# Altium project Carte_Mere.PrjPcb (part 2 of 3)

## Sheet Interface_BUS.SchDoc
size A4; Author: Audran; CompanyName: Goldorak; Address1: Electrolab; Address2: 52 rue Paul Lescop; Address3: 92000 Nanterre; DocumentNumber: 7; SheetNumber: 7; SheetTotal: 8; ProjectName: Cartes_2017
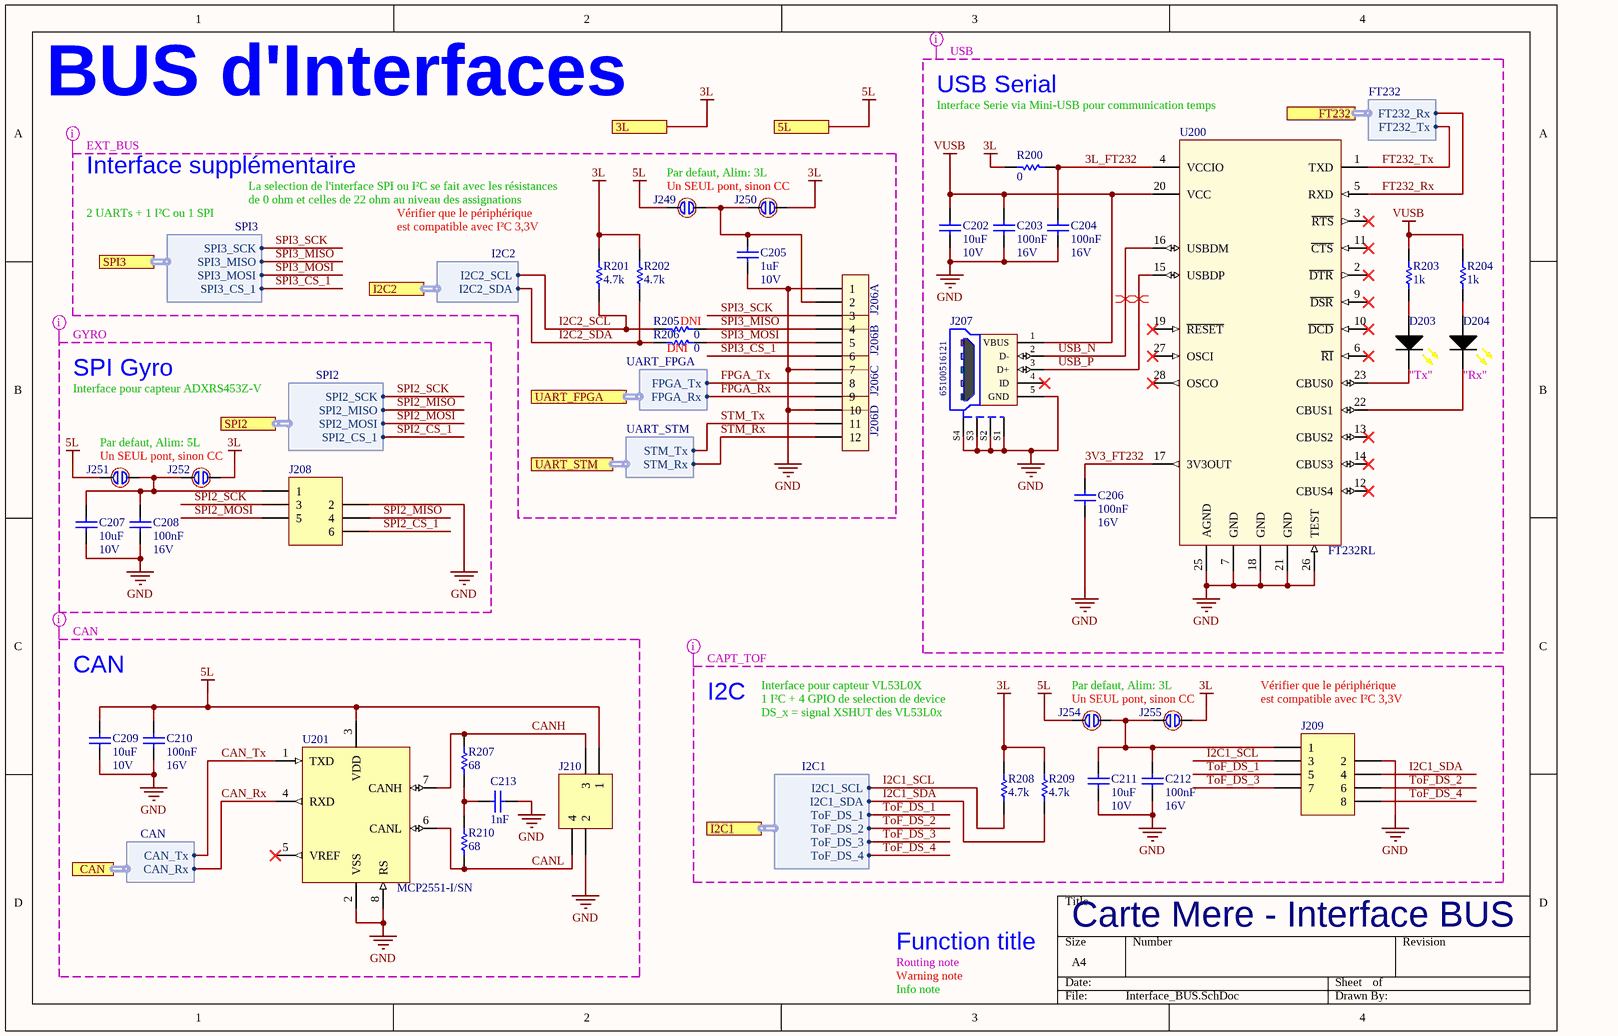
[diagram p4: Interface_BUS.SchDoc]

### Parts
C202  10uF  RatedVoltage: 10V  [WCAP-CSGP_0805, 2x1.25x1.25]
C203  100nF  RatedVoltage: 16V  [WCAP-CSGP_0402, 1x0.5x0.5]
C204  100nF  RatedVoltage: 16V  [WCAP-CSGP_0402, 1x0.5x0.5]
C205  1uF  RatedVoltage: 10V  [WCAP-CSGP_0402, 1x0.5x0.5]
C206  100nF  RatedVoltage: 16V  [WCAP-CSGP_0402, 1x0.5x0.5]
C207  10uF  RatedVoltage: 10V  [WCAP-CSGP_0805, 2x1.25x1.25]
C208  100nF  RatedVoltage: 16V  [WCAP-CSGP_0402, 1x0.5x0.5]
C209  10uF  RatedVoltage: 10V  [WCAP-CSGP_0805, 2x1.25x1.25]
C210  100nF  RatedVoltage: 16V  [WCAP-CSGP_0402, 1x0.5x0.5]
C211  10uF  RatedVoltage: 10V  [WCAP-CSGP_0805, 2x1.25x1.25]
C212  100nF  RatedVoltage: 16V  [WCAP-CSGP_0402, 1x0.5x0.5]
C213  1nF  [WCAP-CSGP_0402, 1x0.5x0.5]
D203  150060YS75000  [SMCW_0603]  (value not drawn)
D204  150060YS75000  [SMCW_0603]  (value not drawn)
J206  TSW-104-08-F-T-RA  [TSW-104-08-F-T-RA]  (value not drawn)  (parts A,B,C,D of 4)
J207  65100516121  [65100516121]
J208  690367280676  [690367280676]  (value not drawn)
J209  690367280876  [690367280876]  (value not drawn)
J210  690367280476  [690367280476]  (value not drawn)
J249  open  [CAVALIER]  (value not drawn)  (no BOM)
J250  open  [CAVALIER]  (value not drawn)  (no BOM)
J251  open  [CAVALIER]  (value not drawn)  (no BOM)
J252  open  [CAVALIER]  (value not drawn)  (no BOM)
J254  open  [CAVALIER]  (value not drawn)  (no BOM)
J255  open  [CAVALIER]  (value not drawn)  (no BOM)
R200  value 0  [RESC1608X06N]  (hidden comment: RC0603FR-070RL)
R201  value 4.7k  [RESC1005X04N]  (hidden comment: RC0402FR-074K7L)
R202  value 4.7k  [RESC1005X04N]  (hidden comment: RC0402FR-074K7L)
R203  value 1k  [RESC1005X04N]  (hidden comment: RC0402FR-071KL)
R204  value 1k  [RESC1005X04N]  (hidden comment: RC0402FR-071KL)
R205  value 0  [RESC1608X06N]  (hidden comment: RC0603FR-070RL)
R206  value 0  [RESC1608X06N]  (hidden comment: RC0603FR-070RL)
R207  value 68  [RESC1608X06N]  (hidden comment: RC0603FR-0768RL)
R208  value 4.7k  [RESC1005X04N]  (hidden comment: RC0402FR-074K7L)
R209  value 4.7k  [RESC1005X04N]  (hidden comment: RC0402FR-074K7L)
R210  value 68  [RESC1608X06N]  (hidden comment: RC0603FR-0768RL)
U200  FT232RL  [SSOP28]
U201  MCP2551-I/SN  [SOIC127P600X175-8N]

### Ports
3L, 5L, CAN (harness CAN), FT232 (harness FT232), I2C1 (harness I2C1), I2C2 (harness I2C2), SPI2 (harness SPI2), SPI3 (harness SPI3), UART_FPGA (harness UART_FPGA), UART_STM (harness UART_STM)

### Harnesses
I2C1: I2C1_SCL, I2C1_SDA, ToF_DS_1, ToF_DS_2, ToF_DS_3, ToF_DS_4
SPI2: SPI2_SCK, SPI2_MISO, SPI2_MOSI, SPI2_CS_1
CAN: CAN_Rx, CAN_Tx
FT232: FT232_Tx, FT232_Rx
SPI3: SPI3_SCK, SPI3_MISO, SPI3_MOSI, SPI3_CS_1
I2C2: I2C2_SCL, I2C2_SDA
UART_FPGA: FPGA_Tx, FPGA_Rx
UART_STM: STM_Tx, STM_Rx

### Nets
3L: J250.2 J252.2 J255.2 R200.1 R201.2 R202.2 R208.2 R209.2 ; port 3L
5L: C209.1 C210.1 J210.1 J249.1 J251.1 J254.1 U201.3(VDD) ; port 5L
GND: C202.2 C203.2 C204.2 C205.2 C206.2 C207.2 C208.2 C209.2 C210.2 C211.2 C212.2 C213.2 J206.1 J206.7 J206.10 J207.5(GND) J207.S1(Shield) J207.S2(Shield) J207.S3(Shield) J207.S4(Shield) J208.2 J209.2 J210.2 U200.7(GND) U200.18(GND) U200.21(GND) U200.25(AGND) U200.26(TEST) U201.2(VSS) U201.8(RS)
VUSB: C202.1 C203.1 J207.1(VBUS) R203.1 R204.1 U200.20(VCC)
3L_FT232: C204.1 R200.2 U200.4(VCCIO)
3V3_FT232: C206.1 U200.17(3V3OUT)
CAN_Rx: U201.4(RXD) ; port CAN.CAN_Rx
CAN_Tx: U201.1(TXD) ; port CAN.CAN_Tx
CANH: J210.3 R207.2 U201.7(CANH)
CANL: J210.4 R210.1 U201.6(CANL)
FPGA_Rx: J206.9 ; port UART_FPGA.FPGA_Rx
FPGA_Tx: J206.8 ; port UART_FPGA.FPGA_Tx
FT232_Rx: U200.5(RXD) ; port FT232.FT232_Rx
FT232_Tx: U200.1(TXD) ; port FT232.FT232_Tx
I2C1_SCL: J209.3 R208.1 ; port I2C1.I2C1_SCL
I2C1_SDA: J209.4 R209.1 ; port I2C1.I2C1_SDA
I2C2_SCL: R201.1 R205.1 ; port I2C2.I2C2_SCL
I2C2_SDA: R202.1 R206.1 ; port I2C2.I2C2_SDA
SPI2_CS_1: J208.6 ; port SPI2.SPI2_CS_1
SPI2_MISO: J208.4 ; port SPI2.SPI2_MISO
SPI2_MOSI: J208.5 ; port SPI2.SPI2_MOSI
SPI2_SCK: J208.3 ; port SPI2.SPI2_SCK
SPI3_CS_1: J206.6 ; port SPI3.SPI3_CS_1
SPI3_MISO: J206.4 R205.2 ; port SPI3.SPI3_MISO
SPI3_MOSI: J206.5 R206.2 ; port SPI3.SPI3_MOSI
SPI3_SCK: J206.3 ; port SPI3.SPI3_SCK
STM_Rx: J206.12 ; port UART_STM.STM_Rx
STM_Tx: J206.11 ; port UART_STM.STM_Tx
ToF_DS_1: J209.5 ; port I2C1.ToF_DS_1
ToF_DS_2: J209.6 ; port I2C1.ToF_DS_2
ToF_DS_3: J209.7 ; port I2C1.ToF_DS_3
ToF_DS_4: J209.8 ; port I2C1.ToF_DS_4
USB_N: J207.2(D-) U200.16(USBDM)
USB_P: J207.3(D+) U200.15(USBDP)
NetC205_1: C205.1 J206.2 J249.2 J250.1
NetC207_1: C207.1 C208.1 J208.1 J251.2 J252.1
NetC211_1: C211.1 C212.1 J209.1 J254.2 J255.1
NetC213_1: C213.1 R207.1 R210.2
NetD203_1: D203.1(C) U200.23(CBUS0)
NetD203_2: D203.2(A) R203.2
NetD204_1: D204.1(C) U200.22(CBUS1)
NetD204_2: D204.2(A) R204.2

Not connected (* = marked no-connect by the designer): J207 4(ID)*; U200 2(~{DTR})* 3(~{RTS})* 6(~{RI})* 9(~{DSR})* 10(~{DCD})* 11(~{CTS})* 12(CBUS4)* 13(CBUS2)* 14(CBUS3)* 19(~{RESET})* 27(OSCI)* 28(OSCO)*; U201 5(VREF)*

### Layout directives
differential pair: USB_N, USB_P
net class USB: 3L, 3L_FT232, 3V3_FT232, FT232_Rx, FT232_Tx, GND, USB_N, USB_P, VUSB
net class CAPT_TOF: 3L, 5L, GND, I2C1_SCL, I2C1_SDA, ToF_DS_1, ToF_DS_2, ToF_DS_3, ToF_DS_4
net class CAN: 5L, CAN_Rx, CAN_Tx, CANH, CANL, GND
net class GYRO: 3L, 5L, GND, SPI2_CS_1, SPI2_MISO, SPI2_MOSI, SPI2_SCK
net class EXT_BUS: 3L, 5L, FPGA_Rx, FPGA_Tx, GND, I2C2_SCL, I2C2_SDA, SPI3_CS_1, SPI3_MISO, SPI3_MOSI, SPI3_SCK, STM_Rx, STM_Tx

### Notes on the sheet
- BUS d'Interfaces
- USB Serial
- Interface Serie via Mini-USB pour communication temps
- Interface supplémentaire
- Par defaut, Alim: 3L
- 2 UARTs + 1 I²C ou 1 SPI
- (near J249) La selection de l'interface SPI ou I²C se fait avec les résistances
- de 0 ohm et celles de 22 ohm au niveau des assignations
- (near R201) Vérifier que le périphérique
- (near R201) est compatible avec I²C 3,3V
- Un SEUL pont, sinon CC
- SPI Gyro
- (near R206) DNI
- (near R205) DNI
- "Tx"
- (near D204) "Rx"
- Interface pour capteur ADXRS453Z-V
- Par defaut, Alim: 5L
- CAN
- I2C
- Interface pour capteur VL53L0X
- 1 I²C + 4 GPIO de selection de device
- DS_x = signal XSHUT des VL53L0x
- Vérifier que le périphérique
- (near J209) est compatible avec I²C 3,3V
- Routing note
- Warning note
- Function title
- Carte Mere - Interface BUS
- Info note

### Library data of the parts
C202 C207 C209 C211 = WCAP-CSGP, 885012207026: as C200 on sheet DE0_Nano; ComponentLink1Description: Datasheet; ComponentLink1URL: http://katalog.we-online.com/pbs/datasheet/885012207026.pdf; Manufacturer Part Number: 885012207026; Value: 10uF; Size: 0805; CeramicType: X7R; Supplier 1: Farnell; Supplier Part Number 1: 2495189; Supplier Part Number 2: C15850; Supplier 2: JLCPCB; Supplier Footprint 2: 0805
C203 C204 C206 C208 C210 C212 = WCAP-CSGP, 885012205037: as C201 on sheet DE0_Nano; ComponentLink1Description: Datasheet; ComponentLink1URL: http://katalog.we-online.com/pbs/datasheet/885012205037.pdf; Manufacturer Part Number: 885012205037; Value: 100nF; Size: 0402; CeramicType: X7R; Supplier 2: JLCPCB; Supplier Part Number 2: C1525; Supplier Footprint 2: 0402
C205 = WCAP-CSGP, 885012105012: CAP CER 1UF 10V X5R 0402; Manufacturer: Wurth Elektronik; ComponentLink1Description: Datasheet; ComponentLink1URL: http://katalog.we-online.com/pbs/datasheet/885012105012.pdf; Manufacturer Part Number: 885012105012; Value: 1uF; Size: 0402; CeramicType: X5R; Supplier 2: JLCPCB; Supplier Part Number 2: C52923; Supplier Footprint 2: 0402
C213 = WCAP-CSGP, 885012205061: CAP CER 1nF 50V X7R 0402; Manufacturer: Wurth Elektronik; ComponentLink1Description: Datasheet; ComponentLink1URL: http://katalog.we-online.com/pbs/datasheet/885012205061.pdf; Manufacturer Part Number: 885012205061; Value: 1nF; Size: 0402; CeramicType: X7R; RatedVoltage: 50V; Supplier 2: JLCPCB; Supplier Part Number 2: C1523; Supplier Footprint 2: 0402
D203 D204 = WL-SMCW 0603  150060YS75000: SMD mono-color Chip LED, WL-SMCW, Yellow; Manufacturer: Wurth Elektronik; Value: Jaune; Manufacturer Part Number: 150060YS75000; ComponentLink1Description: Datasheet; ComponentLink1URL: http://katalog.we-online.com/led/datasheet/150060YS75000.pdf; Supplier 1: Farnell; Supplier Part Number 1: 2322074; Supplier 2: JLCPCB; Supplier Part Number 2: C72038; Supplier Footprint 2: LED_0603
J206 = TSW-104-08-F-T-RA: CONN HEADER R/A 3L x 4POS 2.54MM; Manufacturer: SAMTEC; Manufacturer Part Number: TSW-104-08-F-T-RA; Supplier 1: Farnell; Supplier Part Number 1: 2053041; ComponentLink1Description: Datasheet; ComponentLink1URL: http://cloud.samtec.com/catalog_english/TSW_TH.PDF
J207 = 65100516121: Mini USB 2.0 Type B, Receptacle, Horizontal, SMT; Manufacturer: Wurth Elektronik; Value: 5; ComponentLink1Description: Manufacturer; ComponentLink1URL: https://www.we-online.com/catalog/en/COM_SMT_MINI_TYPE_B_HORIZONTAL/#65100516121; ComponentLink2Description: Datasheet; ComponentLink2URL: https://katalog.we-online.com/em/datasheet/65100516121.pdf; Manufacturer Part Number: 65100516121; Supplier 1: Farnell; Supplier Part Number 1: 1642036
J208 = 690367280676: WR-MM 6p Female SMT Connector with Polarization; Manufacturer: Wurth Electronics Inc.; Value: 6; ComponentLink1Description: Datasheet; ComponentLink1URL: http://katalog.we-online.de/em/datasheet/69036728xx76.pdf; Manufacturer Part Number: 690367280676; Supplier 1: Farnell; Supplier Part Number 1: 1641849
J209 = 690367280876: as J241 on sheet Capteur; ComponentLink1Description: Datasheet; ComponentLink1URL: http://katalog.we-online.de/em/datasheet/69036728xx76.pdf; Manufacturer Part Number: 690367280876; Supplier 1: Farnell; Supplier Part Number 1: 1641850
J210 = 690367280476: WR-MM 4p Female SMT Connector with Polarization; Manufacturer: Wurth Electronics Inc.; Value: 4; ComponentLink1Description: Datasheet; ComponentLink1URL: http://katalog.we-online.de/em/datasheet/69036728xx76.pdf; Manufacturer Part Number: 690367280476; Supplier 1: Farnell; Supplier Part Number 1: 1641848
J249-J252 J254 J255 = CAVALIER_DOT: Cavalier soudure "ouvert", pastille fendue 1.2mm
R200 R205 R206 = RC0603FR-070RL: as R251 on sheet Capteur; Manufacturer Part Number: RC0603FR-070RL; Type: Thick Film; ComponentLink1Description: Manufacturer; ComponentLink1URL: http://www.yageo.com/NewPortal/_en/index.jsp; ComponentLink2Description: Datasheet; ComponentLink2URL: http://www.farnell.com/datasheets/2167052.pdf; Supplier 1: Farnell; Precision: ±1%; Supplier Part Number 1: 2309106; Supplier 2: JLCPCB; Supplier Part Number 2: C21189; Supplier Footprint 2: 0603
R201 R202 R208 R209 = RC0402FR-074K7L: RES SMD 4K7 OHM 1% 1/16W 0402; Manufacturer: Yageo; Power: 63mW; Vmax: 50V; Type: Thick Film; ComponentLink1Description: Manufacturer; ComponentLink1URL: http://www.yageo.com/NewPortal/_en/index.jsp; ComponentLink2Description: Datasheet; ComponentLink2URL: http://www.farnell.com/datasheets/2167052.pdf; Manufacturer Part Number: RC0402FR-074K7L; Supplier 1: Farnell; Supplier Part Number 1: 9239316; Precision: ±1%; Supplier 2: JLCPCB; Supplier Part Number 2: C25900; Supplier Footprint 2: 0402
R203 R204 = RC0402FR-071KL: RES SMD 1K OHM 1% 1/16W 0402; Manufacturer: Yageo; Power: 63mW; Vmax: 50V; Type: Thick Film; ComponentLink1Description: Manufacturer; ComponentLink1URL: http://www.yageo.com/NewPortal/_en/index.jsp; ComponentLink2Description: Datasheet; ComponentLink2URL: http://www.farnell.com/datasheets/2167052.pdf; Manufacturer Part Number: RC0402FR-071KL; Supplier 1: Farnell; Supplier Part Number 1: 9239235; Precision: ±1%; Supplier 2: JLCPCB; Supplier Part Number 2: C11702; Supplier Footprint 2: 0402
R207 R210 = RC0603FR-0768RL: RES SMD 68 OHM 1% 1/10W 0603; Manufacturer: Yageo; Power: 100mW; Vmax: 50V; Manufacturer Part Number: RC0603FR-0768RL; Type: Thick Film; ComponentLink1Description: Manufacturer; ComponentLink1URL: http://www.yageo.com/NewPortal/_en/index.jsp; ComponentLink2Description: Datasheet; ComponentLink2URL: http://www.farnell.com/datasheets/1868787.pdf; Supplier 1: Farnell; Supplier Part Number 1: 9238344; Precision: ±1%; Supplier 2: JLCPCB; Supplier Part Number 2: C27592; Supplier Footprint 2: 0603
U200 = FT232RL: USB VERS UART CMS SSOP28 232; Manufacturer: FTDI; Manufacturer Part Number: FT232RL; Supplier 1: Farnell; Supplier Part Number 1: 1146032; ComponentLink1Description: Datasheet; ComponentLink1URL: http://www.farnell.com/datasheets/2007793.pdf; Supplier 2: JLCPCB; Supplier Footprint 2: SSOP-28_5.3x10.2x0.65P; Supplier Part Number 2: C8690
U201 = MCP2551-I/SN: IC TRANSCEIVER CAN HI-SPD 8-SOIC; Manufacturer: Microchip Technology; Manufacturer Part Number: MCP2551-I/SN; ComponentLink1Description: Datasheet; ComponentLink1URL: http://www.farnell.com/datasheets/657417.pdf; Supplier 1: Farnell; Supplier Part Number 1: 9758569; Supplier 2: JLCPCB; Supplier Part Number 2: C7439; Supplier Footprint 2: SOIC-8_3.9x4.9x1.27P

## Sheet Motorisation.SchDoc
size A4; Author: Audran; CompanyName: Goldorak; Address1: Electrolab; Address2: 52 rue Paul Lescop; Address3: 92000 Nanterre; DocumentNumber: 8; SheetNumber: 8; SheetTotal: 8; ProjectName: Cartes_2017
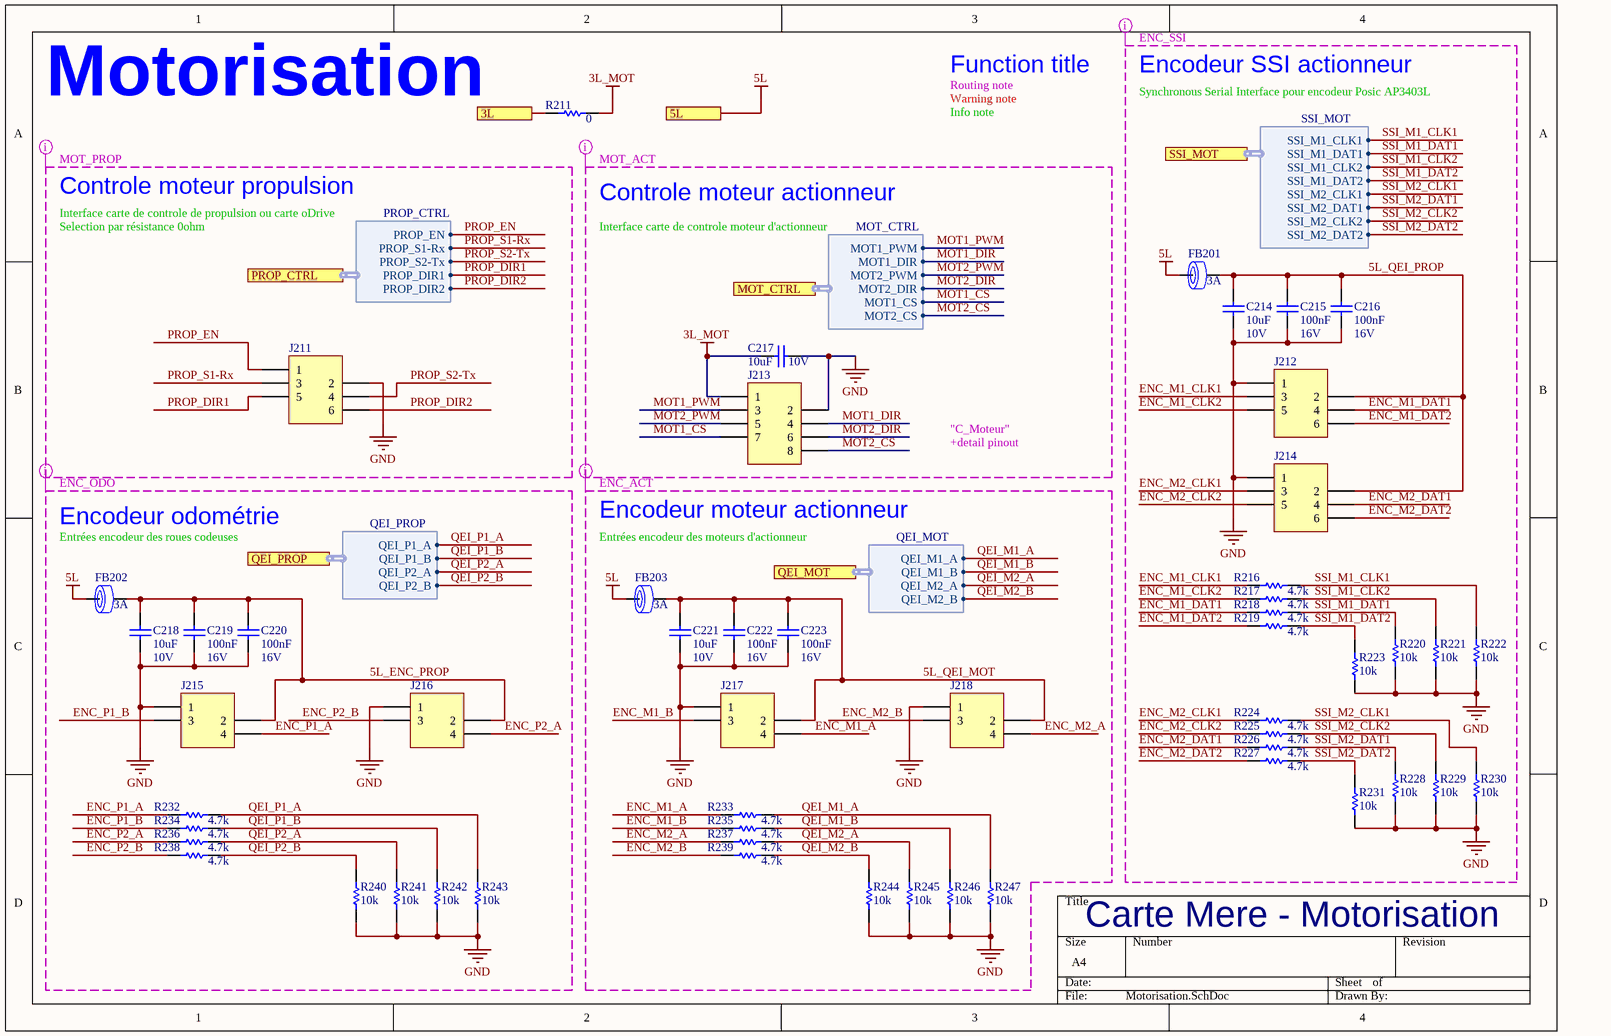
[diagram p5: Motorisation.SchDoc]

### Parts
C214  10uF  RatedVoltage: 10V  [WCAP-CSGP_0805, 2x1.25x1.25]
C215  100nF  RatedVoltage: 16V  [WCAP-CSGP_0402, 1x0.5x0.5]
C216  100nF  RatedVoltage: 16V  [WCAP-CSGP_0402, 1x0.5x0.5]
C217  10uF  RatedVoltage: 10V  [WCAP-CSGP_0805, 2x1.25x1.25]
C218  10uF  RatedVoltage: 10V  [WCAP-CSGP_0805, 2x1.25x1.25]
C219  100nF  RatedVoltage: 16V  [WCAP-CSGP_0402, 1x0.5x0.5]
C220  100nF  RatedVoltage: 16V  [WCAP-CSGP_0402, 1x0.5x0.5]
C221  10uF  RatedVoltage: 10V  [WCAP-CSGP_0805, 2x1.25x1.25]
C222  100nF  RatedVoltage: 16V  [WCAP-CSGP_0402, 1x0.5x0.5]
C223  100nF  RatedVoltage: 16V  [WCAP-CSGP_0402, 1x0.5x0.5]
FB201  RatedCurrent: 3A  [WE-CBF_0805_High Current]  (hidden comment: 742792023)
FB202  RatedCurrent: 3A  [WE-CBF_0805_High Current]  (hidden comment: 742792023)
FB203  RatedCurrent: 3A  [WE-CBF_0805_High Current]  (hidden comment: 742792023)
J211  690367280676  [690367280676]  (value not drawn)
J212  690367280676  [690367280676]  (value not drawn)
J213  690367280876  [690367280876]  (value not drawn)
J214  690367280676  [690367280676]  (value not drawn)
J215  690367280476  [690367280476]  (value not drawn)
J216  690367280476  [690367280476]  (value not drawn)
J217  690367280476  [690367280476]  (value not drawn)
J218  690367280476  [690367280476]  (value not drawn)
R211  value 0  [RESC1608X06N]  (hidden comment: RC0603FR-070RL)
R216  value 4.7k  [RESC1005X04N]  (hidden comment: RC0402FR-074K7L)
R217  value 4.7k  [RESC1005X04N]  (hidden comment: RC0402FR-074K7L)
R218  value 4.7k  [RESC1005X04N]  (hidden comment: RC0402FR-074K7L)
R219  value 4.7k  [RESC1005X04N]  (hidden comment: RC0402FR-074K7L)
R220  value 10k  [RESC1005X04N]  (hidden comment: RC0402FR-0710KL)
R221  value 10k  [RESC1005X04N]  (hidden comment: RC0402FR-0710KL)
R222  value 10k  [RESC1005X04N]  (hidden comment: RC0402FR-0710KL)
R223  value 10k  [RESC1005X04N]  (hidden comment: RC0402FR-0710KL)
R224  value 4.7k  [RESC1005X04N]  (hidden comment: RC0402FR-074K7L)
R225  value 4.7k  [RESC1005X04N]  (hidden comment: RC0402FR-074K7L)
R226  value 4.7k  [RESC1005X04N]  (hidden comment: RC0402FR-074K7L)
R227  value 4.7k  [RESC1005X04N]  (hidden comment: RC0402FR-074K7L)
R228  value 10k  [RESC1005X04N]  (hidden comment: RC0402FR-0710KL)
R229  value 10k  [RESC1005X04N]  (hidden comment: RC0402FR-0710KL)
R230  value 10k  [RESC1005X04N]  (hidden comment: RC0402FR-0710KL)
R231  value 10k  [RESC1005X04N]  (hidden comment: RC0402FR-0710KL)
R232  value 4.7k  [RESC1005X04N]  (hidden comment: RC0402FR-074K7L)
R233  value 4.7k  [RESC1005X04N]  (hidden comment: RC0402FR-074K7L)
R234  value 4.7k  [RESC1005X04N]  (hidden comment: RC0402FR-074K7L)
R235  value 4.7k  [RESC1005X04N]  (hidden comment: RC0402FR-074K7L)
R236  value 4.7k  [RESC1005X04N]  (hidden comment: RC0402FR-074K7L)
R237  value 4.7k  [RESC1005X04N]  (hidden comment: RC0402FR-074K7L)
R238  value 4.7k  [RESC1005X04N]  (hidden comment: RC0402FR-074K7L)
R239  value 4.7k  [RESC1005X04N]  (hidden comment: RC0402FR-074K7L)
R240  value 10k  [RESC1005X04N]  (hidden comment: RC0402FR-0710KL)
R241  value 10k  [RESC1005X04N]  (hidden comment: RC0402FR-0710KL)
R242  value 10k  [RESC1005X04N]  (hidden comment: RC0402FR-0710KL)
R243  value 10k  [RESC1005X04N]  (hidden comment: RC0402FR-0710KL)
R244  value 10k  [RESC1005X04N]  (hidden comment: RC0402FR-0710KL)
R245  value 10k  [RESC1005X04N]  (hidden comment: RC0402FR-0710KL)
R246  value 10k  [RESC1005X04N]  (hidden comment: RC0402FR-0710KL)
R247  value 10k  [RESC1005X04N]  (hidden comment: RC0402FR-0710KL)

### Ports
3L, 5L, MOT_CTRL (harness MOT_CTRL), PROP_CTRL (harness PROP_CTRL), QEI_MOT (harness QEI_MOT), QEI_PROP (harness QEI_PROP), SSI_MOT (harness SSI_MOT)

### Harnesses
PROP_CTRL: PROP_EN, PROP_S1-Rx, PROP_S2-Tx, PROP_DIR1, PROP_DIR2
QEI_PROP: QEI_P1_A, QEI_P1_B, QEI_P2_A, QEI_P2_B
QEI_MOT: QEI_M1_A, QEI_M1_B, QEI_M2_A, QEI_M2_B
SSI_MOT: SSI_M1_CLK1, SSI_M1_DAT1, SSI_M1_CLK2, SSI_M1_DAT2, SSI_M2_CLK1, SSI_M2_DAT1, SSI_M2_CLK2, SSI_M2_DAT2
MOT_CTRL: MOT1_PWM, MOT1_DIR, MOT2_PWM, MOT2_DIR, MOT1_CS, MOT2_CS

### Nets
3L: R211.1 ; port 3L
3L_MOT: C217.1 J213.1 R211.2
5L: FB201.1 FB202.1 FB203.1 ; port 5L
GND: C214.2 C215.2 C216.2 C217.2 C218.2 C219.2 C220.2 C221.2 C222.2 C223.2 J211.2 J212.1 J213.2 J214.1 J215.1 J216.1 J217.1 J218.1 R220.1 R221.1 R222.1 R223.1 R228.1 R229.1 R230.1 R231.1 R240.1 R241.1 R242.1 R243.1 R244.1 R245.1 R246.1 R247.1
5L_ENC_PROP: C218.1 C219.1 C220.1 FB202.2 J215.2 J216.2
5L_QEI_MOT: C221.1 C222.1 C223.1 FB203.2 J217.2 J218.2
5L_QEI_PROP: C214.1 C215.1 C216.1 FB201.2 J212.2 J214.2
ENC_M1_A: J217.4 R233.1
ENC_M1_B: J217.3 R235.1
ENC_M1_CLK1: J212.3 R216.1
ENC_M1_CLK2: J212.5 R217.1
ENC_M1_DAT1: J212.4 R218.1
ENC_M1_DAT2: J212.6 R219.1
ENC_M2_A: J218.4 R237.1
ENC_M2_B: J218.3 R239.1
ENC_M2_CLK1: J214.3 R224.1
ENC_M2_CLK2: J214.5 R225.1
ENC_M2_DAT1: J214.4 R226.1
ENC_M2_DAT2: J214.6 R227.1
ENC_P1_A: J215.4 R232.1
ENC_P1_B: J215.3 R234.1
ENC_P2_A: J216.4 R236.1
ENC_P2_B: J216.3 R238.1
MOT1_CS: J213.7 ; port MOT_CTRL.MOT1_CS
MOT1_DIR: J213.4 ; port MOT_CTRL.MOT1_DIR
MOT1_PWM: J213.3 ; port MOT_CTRL.MOT1_PWM
MOT2_CS: J213.8 ; port MOT_CTRL.MOT2_CS
MOT2_DIR: J213.6 ; port MOT_CTRL.MOT2_DIR
MOT2_PWM: J213.5 ; port MOT_CTRL.MOT2_PWM
PROP_DIR1: J211.5 ; port PROP_CTRL.PROP_DIR1
PROP_DIR2: J211.6 ; port PROP_CTRL.PROP_DIR2
PROP_EN: J211.1 ; port PROP_CTRL.PROP_EN
PROP_S1-Rx: J211.3 ; port PROP_CTRL.PROP_S1-Rx
PROP_S2-Tx: J211.4 ; port PROP_CTRL.PROP_S2-Tx
QEI_M1_A: R233.2 R247.2 ; port QEI_MOT.QEI_M1_A
QEI_M1_B: R235.2 R246.2 ; port QEI_MOT.QEI_M1_B
QEI_M2_A: R237.2 R245.2 ; port QEI_MOT.QEI_M2_A
QEI_M2_B: R239.2 R244.2 ; port QEI_MOT.QEI_M2_B
QEI_P1_A: R232.2 R243.2 ; port QEI_PROP.QEI_P1_A
QEI_P1_B: R234.2 R242.2 ; port QEI_PROP.QEI_P1_B
QEI_P2_A: R236.2 R241.2 ; port QEI_PROP.QEI_P2_A
QEI_P2_B: R238.2 R240.2 ; port QEI_PROP.QEI_P2_B
SSI_M1_CLK1: R216.2 R222.2 ; port SSI_MOT.SSI_M1_CLK1
SSI_M1_CLK2: R217.2 R221.2 ; port SSI_MOT.SSI_M1_CLK2
SSI_M1_DAT1: R218.2 R220.2 ; port SSI_MOT.SSI_M1_DAT1
SSI_M1_DAT2: R219.2 R223.2 ; port SSI_MOT.SSI_M1_DAT2
SSI_M2_CLK1: R224.2 R230.2 ; port SSI_MOT.SSI_M2_CLK1
SSI_M2_CLK2: R225.2 R229.2 ; port SSI_MOT.SSI_M2_CLK2
SSI_M2_DAT1: R226.2 R228.2 ; port SSI_MOT.SSI_M2_DAT1
SSI_M2_DAT2: R227.2 R231.2 ; port SSI_MOT.SSI_M2_DAT2

### Layout directives
net class MOT_PROP: GND, PROP_DIR1, PROP_DIR2, PROP_EN, PROP_S1-Rx, PROP_S2-Tx
net class MOT_ACT: 3L_MOT, GND, MOT1_CS, MOT1_DIR, MOT1_PWM, MOT2_CS, MOT2_DIR, MOT2_PWM
net class ENC_ODO: 5L, 5L_ENC_PROP, ENC_P1_A, ENC_P1_B, ENC_P2_A, ENC_P2_B, GND, QEI_P1_A, QEI_P1_B, QEI_P2_A, QEI_P2_B
net class ENC_SSI: 5L, 5L_QEI_PROP, ENC_M1_CLK1, ENC_M1_CLK2, ENC_M1_DAT1, ENC_M1_DAT2, ENC_M2_CLK1, ENC_M2_CLK2, ENC_M2_DAT1, ENC_M2_DAT2, GND, SSI_M1_CLK1, SSI_M1_CLK2, SSI_M1_DAT1, SSI_M1_DAT2, SSI_M2_CLK1, SSI_M2_CLK2, SSI_M2_DAT1, SSI_M2_DAT2
net class ENC_ACT: 5L, 5L_QEI_MOT, ENC_M1_A, ENC_M1_B, ENC_M2_A, ENC_M2_B, GND, QEI_M1_A, QEI_M1_B, QEI_M2_A, QEI_M2_B

### Notes on the sheet
- Motorisation
- Routing note
- Warning note
- Info note
- Function title
- Encodeur SSI actionneur
- Synchronous Serial Interface pour encodeur Posic AP3403L
- Controle moteur propulsion
- Interface carte de controle de propulsion ou carte oDrive
- Selection par résistance 0ohm
- Controle moteur actionneur
- Interface carte de controle moteur d'actionneur
- "C_Moteur"
- +detail pinout
- Encodeur moteur actionneur
- Encodeur odométrie
- Entrées encodeur des roues codeuses
- Entrées encodeur des moteurs d'actionneur
- Carte Mere - Motorisation

### Library data of the parts
C214 C217 C218 C221 = WCAP-CSGP, 885012207026: CAP CER 10uF 10V X7R 0805; Manufacturer: Wurth Elektronik; ComponentLink1Description: Datasheet; ComponentLink1URL: http://katalog.we-online.com/pbs/datasheet/885012207026.pdf; Manufacturer Part Number: 885012207026; Value: 10uF; Size: 0805; CeramicType: X7R; Supplier 1: Farnell; Supplier Part Number 1: 2495189; Supplier Part Number 2: C15850; Supplier 2: JLCPCB; Supplier Footprint 2: 0805
C215 C216 C219 C220 C222 C223 = WCAP-CSGP, 885012205037: CAP CER 100nF 16V X7R 0402; Manufacturer: Wurth Elektronik; ComponentLink1Description: Datasheet; ComponentLink1URL: http://katalog.we-online.com/pbs/datasheet/885012205037.pdf; Manufacturer Part Number: 885012205037; Value: 100nF; Size: 0402; CeramicType: X7R; Supplier 2: JLCPCB; Supplier Part Number 2: C1525; Supplier Footprint 2: 0402
FB201-FB203 = WE-CBF, 742792023: Ferrite Bead 120ohm 0805 3A; Manufacturer: Wurth Elektronik; Value: 120; ComponentLink1Description: Manufacturer; ComponentLink1URL: https://www.we-online.com/catalog/en/WE-CBF/?sq=742792023#742792023; ComponentLink2Description: Datasheet; ComponentLink2URL: https://www.we-online.com/catalog/datasheet/742792023.pdf; Manufacturer Part Number: 742792023; Supplier 2: JLCPCB; Supplier Part Number 2: C1015; Supplier 1: Farnell; Supplier Part Number 1: 1635732; Supplier Footprint 2: 0805
J211 J212 J214 = 690367280676: WR-MM 6p Female SMT Connector with Polarization; Manufacturer: Wurth Electronics Inc.; Value: 6; ComponentLink1Description: Datasheet; ComponentLink1URL: http://katalog.we-online.de/em/datasheet/69036728xx76.pdf; Manufacturer Part Number: 690367280676; Supplier 1: Farnell; Supplier Part Number 1: 1641849
J213 = 690367280876: WR-MM 8p Female SMT Connector with Polarization; Manufacturer: Wurth Electronics Inc.; Value: 8; Manufacturer Part Number: 690367280876; ComponentLink1Description: Datasheet; ComponentLink1URL: http://katalog.we-online.de/em/datasheet/69036728xx76.pdf; Supplier 1: Farnell; Supplier Part Number 1: 1641850
J215-J218 = 690367280476: WR-MM 4p Female SMT Connector with Polarization; Manufacturer: Wurth Electronics Inc.; Value: 4; ComponentLink1Description: Datasheet; ComponentLink1URL: http://katalog.we-online.de/em/datasheet/69036728xx76.pdf; Manufacturer Part Number: 690367280476; Supplier 1: Farnell; Supplier Part Number 1: 1641848
R211 = RC0603FR-070RL: RES SMD 0 OHM 1% 1/10W 0603; Manufacturer: Yageo; Power: 100mW; Vmax: 50V; Manufacturer Part Number: RC0603FR-070RL; Type: Thick Film; ComponentLink1Description: Manufacturer; ComponentLink1URL: http://www.yageo.com/NewPortal/_en/index.jsp; ComponentLink2Description: Datasheet; ComponentLink2URL: http://www.farnell.com/datasheets/2167052.pdf; Supplier 1: Farnell; Precision: ±1%; Supplier Part Number 1: 2309106; Supplier 2: JLCPCB; Supplier Part Number 2: C21189; Supplier Footprint 2: 0603
R216-R219 R224-R227 R232-R239 = RC0402FR-074K7L: RES SMD 4K7 OHM 1% 1/16W 0402; Manufacturer: Yageo; Power: 63mW; Vmax: 50V; Type: Thick Film; ComponentLink1Description: Manufacturer; ComponentLink1URL: http://www.yageo.com/NewPortal/_en/index.jsp; ComponentLink2Description: Datasheet; ComponentLink2URL: http://www.farnell.com/datasheets/2167052.pdf; Manufacturer Part Number: RC0402FR-074K7L; Supplier 1: Farnell; Supplier Part Number 1: 9239316; Precision: ±1%; Supplier 2: JLCPCB; Supplier Part Number 2: C25900; Supplier Footprint 2: 0402
R220-R223 R228-R231 R240-R247 = RC0402FR-0710KL: RES SMD 10K OHM 1% 1/16W 0402; Manufacturer: Yageo; Power: 63mW; Vmax: 50V; Type: Thick Film; ComponentLink1Description: Manufacturer; ComponentLink1URL: http://www.yageo.com/NewPortal/_en/index.jsp; ComponentLink2Description: Datasheet; ComponentLink2URL: http://www.farnell.com/datasheets/2167052.pdf; Supplier 1: Farnell; Supplier Part Number 1: 9239359; Manufacturer Part Number: RC0402FR-0710KL; Precision: ±1%; Supplier 2: JLCPCB; Supplier Part Number 2: C25744; Supplier Footprint 2: 0402

## Sheet Power.SchDoc
size A4; Author: Audran; CompanyName: Goldorak; Address1: Electrolab; Address2: 52 rue Paul Lescop; Address3: 92000 Nanterre; DocumentNumber: 4; SheetNumber: 4; SheetTotal: 8; ProjectName: Cartes_2017
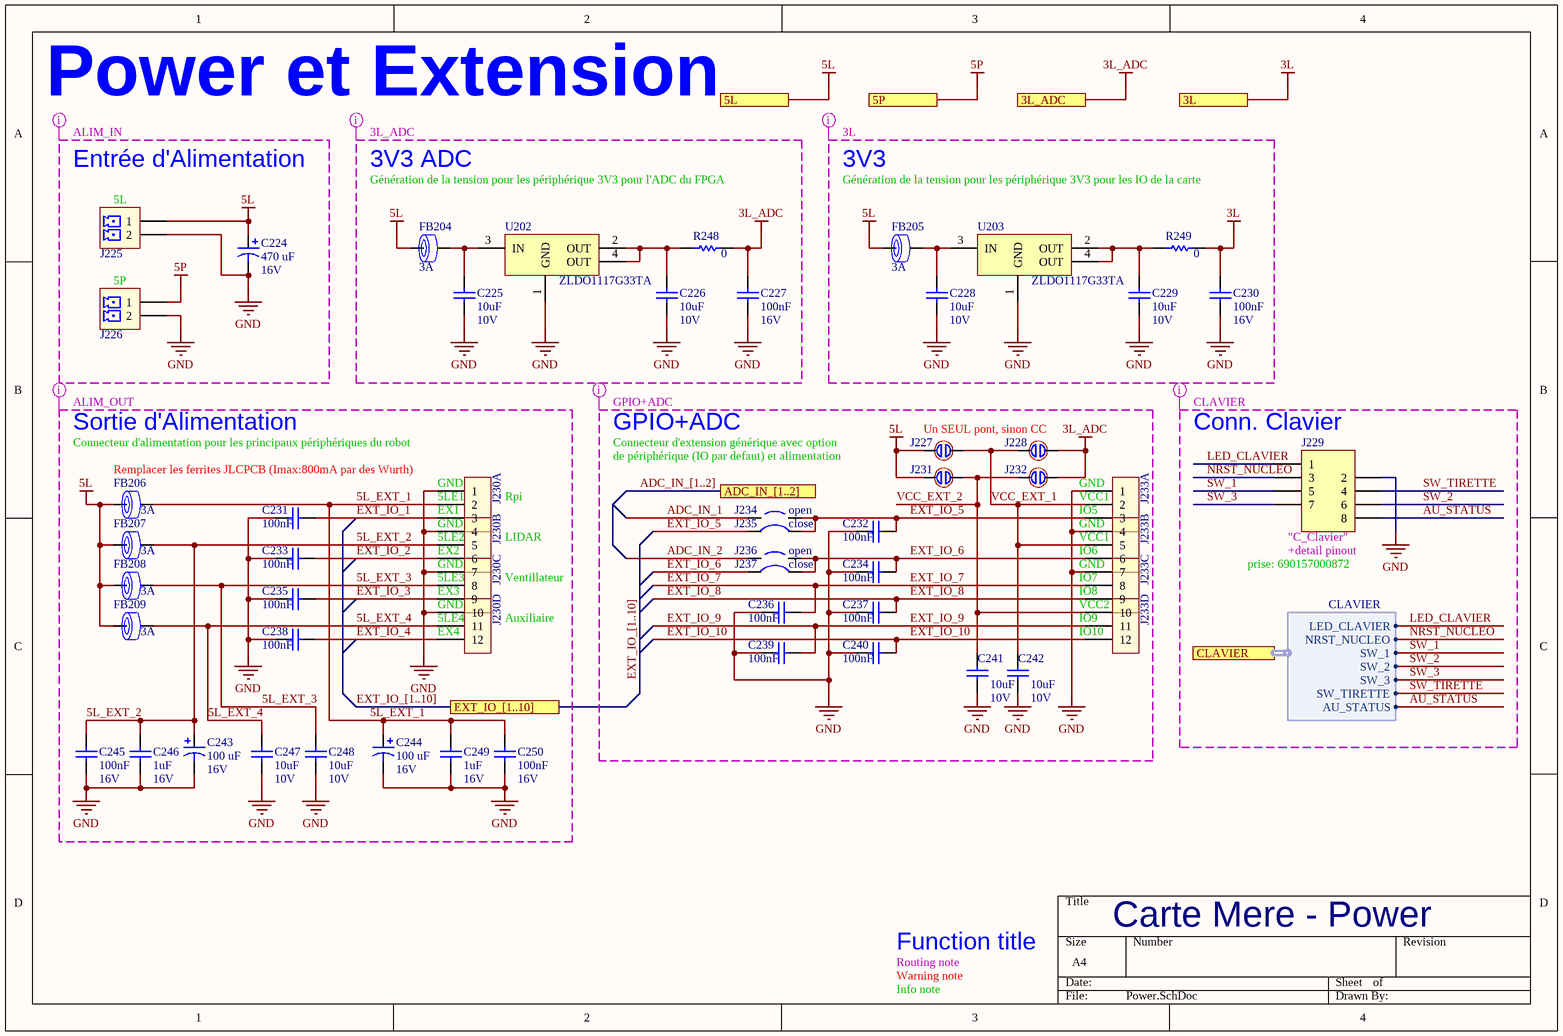
[diagram p6: Power.SchDoc]

### Parts
C224  470 uF  RatedVoltage: 16V  [WCAP-ATG8_8x11.5x3.5x0.5]
C225  10uF  RatedVoltage: 10V  [WCAP-CSGP_0805, 2x1.25x1.25]
C226  10uF  RatedVoltage: 10V  [WCAP-CSGP_0805, 2x1.25x1.25]
C227  100nF  RatedVoltage: 16V  [WCAP-CSGP_0402, 1x0.5x0.5]
C228  10uF  RatedVoltage: 10V  [WCAP-CSGP_0805, 2x1.25x1.25]
C229  10uF  RatedVoltage: 10V  [WCAP-CSGP_0805, 2x1.25x1.25]
C230  100nF  RatedVoltage: 16V  [WCAP-CSGP_0402, 1x0.5x0.5]
C231  100nF  [WCAP-CSGP_0402, 1x0.5x0.5]
C232  100nF  [WCAP-CSGP_0402, 1x0.5x0.5]
C233  100nF  [WCAP-CSGP_0402, 1x0.5x0.5]
C234  100nF  [WCAP-CSGP_0402, 1x0.5x0.5]
C235  100nF  [WCAP-CSGP_0402, 1x0.5x0.5]
C236  100nF  [WCAP-CSGP_0402, 1x0.5x0.5]
C237  100nF  [WCAP-CSGP_0402, 1x0.5x0.5]
C238  100nF  [WCAP-CSGP_0402, 1x0.5x0.5]
C239  100nF  [WCAP-CSGP_0402, 1x0.5x0.5]
C240  100nF  [WCAP-CSGP_0402, 1x0.5x0.5]
C241  10uF  RatedVoltage: 10V  [WCAP-CSGP_0805, 2x1.25x1.25]
C242  10uF  RatedVoltage: 10V  [WCAP-CSGP_0805, 2x1.25x1.25]
C243  100 uF  RatedVoltage: 16V  [WCAP-ATG8_5x11x2x0.5]
C244  100 uF  RatedVoltage: 16V  [WCAP-ATG8_5x11x2x0.5]
C245  100nF  RatedVoltage: 16V  [WCAP-CSGP_0402, 1x0.5x0.5]
C246  1uF  RatedVoltage: 16V  [WCAP-CSGP_0603, 1.6x0.8x0.8]
C247  10uF  RatedVoltage: 10V  [WCAP-CSGP_0805, 2x1.25x1.25]
C248  10uF  RatedVoltage: 10V  [WCAP-CSGP_0805, 2x1.25x1.25]
C249  1uF  RatedVoltage: 16V  [WCAP-CSGP_0603, 1.6x0.8x0.8]
C250  100nF  RatedVoltage: 16V  [WCAP-CSGP_0402, 1x0.5x0.5]
FB204  RatedCurrent: 3A  [WE-CBF_0805_High Current]  (hidden comment: 742792023)
FB205  RatedCurrent: 3A  [WE-CBF_0805_High Current]  (hidden comment: 742792023)
FB206  RatedCurrent: 3A  [WE-CBF_0805_High Current]  (hidden comment: 742792023)
FB207  RatedCurrent: 3A  [WE-CBF_0805_High Current]  (hidden comment: 742792023)
FB208  RatedCurrent: 3A  [WE-CBF_0805_High Current]  (hidden comment: 742792023)
FB209  RatedCurrent: 3A  [WE-CBF_0805_High Current]  (hidden comment: 742792023)
J225  691322110002  [691322110002]  (value not drawn)
J226  691322110002  [691322110002]  (value not drawn)
J227  open  [CAVALIER]  (value not drawn)  (no BOM)
J228  open  [CAVALIER]  (value not drawn)  (no BOM)
J229  690367280876  [690367280876]  (value not drawn)
J230  TSW-104-08-F-T-RA  [TSW-104-08-F-T-RA]  (value not drawn)  (parts A,B,C,D of 4)
J231  open  [CAVALIER]  (value not drawn)  (no BOM)
J232  open  [CAVALIER]  (value not drawn)  (no BOM)
J233  TSW-104-08-F-T-RA  [TSW-104-08-F-T-RA]  (value not drawn)  (parts A,B,C,D of 4)
J234  open  [CAVALIER_0603_O]  (net tie, no BOM)
J235  close  [CAVALIER_0603_C]  (net tie, no BOM)
J236  open  [CAVALIER_0603_O]  (net tie, no BOM)
J237  close  [CAVALIER_0603_C]  (net tie, no BOM)
R248  value 0  [RESC1608X06N]  (hidden comment: RC0603FR-070RL)
R249  value 0  [RESC1608X06N]  (hidden comment: RC0603FR-070RL)
U202  ZLDO1117G33TA  [SOT223]
U203  ZLDO1117G33TA  [SOT223]

### Ports
3L, 3L_ADC, 5L, 5P, ADC_IN_[1..2], CLAVIER (harness CLAVIER), EXT_IO_[1..10]

### Harnesses
CLAVIER: LED_CLAVIER, NRST_NUCLEO, SW_1, SW_2, SW_3, SW_TIRETTE, AU_STATUS

### Nets
3L: C230.1 R249.2 ; port 3L
3L_ADC: C227.1 J228.1 J232.1 R248.2 ; port 3L_ADC
5L: C224.1 FB204.1 FB205.1 FB206.1 FB207.1 FB208.1 FB209.1 J225.1 J227.2 J231.2 ; port 5L
5P: J226.1 ; port 5P
GND: C224.2 C225.2 C226.2 C227.2 C228.2 C229.2 C230.2 C231.2 C232.2 C233.2 C234.2 C235.2 C236.2 C237.2 C238.2 C239.2 C240.2 C241.2 C242.2 C243.2 C244.2 C245.2 C246.2 C247.2 C248.2 C249.2 C250.2 J225.2 J226.2 J229.2 J230.1 J230.4 J230.7 J230.10 J233.1 J233.4 J233.7 U202.1(GND) U203.1(GND)
5L_EXT_1: C244.1 C249.1 C250.1 FB206.2 J230.2
5L_EXT_2: C243.1 C245.1 C246.1 FB207.2 J230.5
5L_EXT_3: C248.1 FB208.2 J230.8
5L_EXT_4: C247.1 FB209.2 J230.11
ADC_IN_1: J234.1
ADC_IN_2: J236.1
AU_STATUS: J229.8 ; port CLAVIER.AU_STATUS
EXT_IO_1: C231.1 J230.3
EXT_IO_2: C233.1 J230.6
EXT_IO_3: C235.1 J230.9
EXT_IO_4: C238.1 J230.12
EXT_IO_5: C232.1 J233.3 J234.2 J235.1 J235.2
EXT_IO_6: C234.1 J233.6 J236.2 J237.1 J237.2
EXT_IO_7: C236.1 J233.8
EXT_IO_8: C237.1 J233.9
EXT_IO_9: C239.1 J233.11
EXT_IO_10: C240.1 J233.12
LED_CLAVIER: J229.1 ; port CLAVIER.LED_CLAVIER
NRST_NUCLEO: J229.3 ; port CLAVIER.NRST_NUCLEO
SW_1: J229.5 ; port CLAVIER.SW_1
SW_2: J229.6 ; port CLAVIER.SW_2
SW_3: J229.7 ; port CLAVIER.SW_3
SW_TIRETTE: J229.4 ; port CLAVIER.SW_TIRETTE
VCC_EXT_1: C242.1 J227.1 J228.2 J233.2 J233.5
VCC_EXT_2: C241.1 J231.1 J232.2 J233.10
NetC225_1: C225.1 FB204.2 U202.3(IN)
NetC226_1: C226.1 R248.1 U202.2(OUT) U202.4(OUT)
NetC228_1: C228.1 FB205.2 U203.3(IN)
NetC229_1: C229.1 R249.1 U203.2(OUT) U203.4(OUT)

### Buses and harness runs
bus ADC_IN_[1..2] = port ADC_IN_[1..2]
bus EXT_IO_[1..10] = port EXT_IO_[1..10]

### Layout directives
net class GPIO+ADC: 3L_ADC, 5L, ADC_IN_1, ADC_IN_2, ADC_IN_[1..2], EXT_IO_5, EXT_IO_6, EXT_IO_7, EXT_IO_8, EXT_IO_9, EXT_IO_10, EXT_IO_[1..10], GND, VCC_EXT_1, VCC_EXT_2
net class ALIM_OUT: 5L, 5L_EXT_1, 5L_EXT_2, 5L_EXT_3, 5L_EXT_4, EXT_IO_1, EXT_IO_2, EXT_IO_3, EXT_IO_4, EXT_IO_[1..10], GND
net class ALIM_IN: 5L, 5P, GND
net class 3L_ADC: 3L_ADC, 5L, GND
net class 3L: 3L, 5L, GND
net class CLAVIER: AU_STATUS, GND, LED_CLAVIER, NRST_NUCLEO, SW_1, SW_2, SW_3, SW_TIRETTE

### Notes on the sheet
- Power et Extension
- Entrée d'Alimentation
- 3V3 ADC
- 3V3
- (near J225) 5L
- Génération de la tension pour les périphérique 3V3 pour l'ADC du FPGA
- Génération de la tension pour les périphérique 3V3 pour les IO de la carte
- (near J226) 5P
- Sortie d'Alimentation
- Connecteur d'alimentation pour les principaux périphériques du robot
- GPIO+ADC
- Connecteur d'extension générique avec option
- Un SEUL pont, sinon CC
- (near J229) Conn. Clavier
- Remplacer les ferrites JLCPCB (Imax:800mA par des Wurth)
- (near J230) 5LE1
- (near J230) GND
- (near J230) EX1
- (near J230) Rpi
- de périphérique (IO par defaut) et alimentation
- (near J233) IO5
- (near J233) VCC1
- (near J233) GND
- (near J230) 5LE2
- (near J230) 5LE3
- (near J230) EX2
- (near J230) LIDAR
- (near J230) Ventillateur
- (near J233) IO6
- (near J233) IO7
- (near J229) prise: 690157000872
- (near J229) "C_Clavier"
- (near J229) +detail pinout
- (near J230) 5LE4
- (near J230) EX3
- (near J230) EX4
- (near J230) Auxiliaire
- (near J233) IO8
- (near J233) IO9
- (near J233) IO10
- (near J233) VCC2
- Routing note
- Warning note
- Function title
- Carte Mere - Power
- Info note

### Library data of the parts
C224 = WCAP-ATG8, 860010374012: CAP Alu 470 UF 20% 16 V; Manufacturer: Wurth Elektronik; ComponentLink1Description: Datasheet; ComponentLink1URL: http://katalog.we-online.de/pbs/datasheet/860010374012.pdf; Manufacturer Part Number: 860010374012; Value: 470 uF; Size: 8mmx11.5mm
C225 C226 C228 C229 C241 C242 C247 C248 = WCAP-CSGP, 885012207026: as C214 on sheet Motorisation; ComponentLink1Description: Datasheet; ComponentLink1URL: http://katalog.we-online.com/pbs/datasheet/885012207026.pdf; Manufacturer Part Number: 885012207026; Value: 10uF; Size: 0805; CeramicType: X7R; Supplier 1: Farnell; Supplier Part Number 1: 2495189; Supplier Part Number 2: C15850; Supplier 2: JLCPCB; Supplier Footprint 2: 0805
C227 C230-C240 C245 C250 = WCAP-CSGP, 885012205037: as C215 on sheet Motorisation; ComponentLink1Description: Datasheet; ComponentLink1URL: http://katalog.we-online.com/pbs/datasheet/885012205037.pdf; Manufacturer Part Number: 885012205037; Value: 100nF; Size: 0402; CeramicType: X7R; Supplier 2: JLCPCB; Supplier Part Number 2: C1525; Supplier Footprint 2: 0402
  C231-C240: RatedVoltage: 16V
C243 C244 = WCAP-ATG8, 860010372006: CAP Alu 100 UF 20% 16 V; Manufacturer: Wurth Elektronik; ComponentLink1Description: Datasheet; ComponentLink1URL: http://katalog.we-online.de/pbs/datasheet/860010372006.pdf; Manufacturer Part Number: 860010372006; Value: 100 uF; Size: 5mmx11mm
C246 C249 = WCAP-CSGP, 885012106017: CAP CER 1UF 16V X5R 0603; Manufacturer: Wurth Elektronik; ComponentLink1Description: Datasheet; ComponentLink1URL: http://katalog.we-online.com/pbs/datasheet/885012106017.pdf; Manufacturer Part Number: 885012106017; Value: 1uF; Size: 0603; CeramicType: X5R; Supplier 2: JLCPCB; Supplier Part Number 2: C15849; Supplier Footprint 2: 0603
FB204-FB209 = WE-CBF, 742792023: as FB201-FB203 on sheet Motorisation; ComponentLink1Description: Manufacturer; ComponentLink1URL: https://www.we-online.com/catalog/en/WE-CBF/?sq=742792023#742792023; ComponentLink2Description: Datasheet; ComponentLink2URL: https://www.we-online.com/catalog/datasheet/742792023.pdf; Manufacturer Part Number: 742792023; Supplier 2: JLCPCB; Supplier Part Number 2: C1015; Supplier 1: Farnell; Supplier Part Number 1: 1635732; Supplier Footprint 2: 0805
J225 J226 = 691322110002: WR-TBL 2p Series 3221 - 3.50 mm Horizontal PCB Header; Manufacturer: Wurth Electronics Inc.; Value: 2; Supplier 1: Farnell; Manufacturer Part Number: 691322110002; ComponentLink1URL: http://katalog.we-online.de/em/datasheet/6913221100xx.pdf; ComponentLink1Description: Datasheet; Supplier Part Number 1: 1841315
J227 J228 J231 J232 = CAVALIER_DOT: Cavalier soudure "ouvert", pastille fendue 1.2mm
J229 = 690367280876: as J213 on sheet Motorisation; Manufacturer Part Number: 690367280876; ComponentLink1Description: Datasheet; ComponentLink1URL: http://katalog.we-online.de/em/datasheet/69036728xx76.pdf; Supplier 1: Farnell; Supplier Part Number 1: 1641850
J230 J233 = TSW-104-08-F-T-RA: CONN HEADER R/A 3L x 4POS 2.54MM; Manufacturer: SAMTEC; Manufacturer Part Number: TSW-104-08-F-T-RA; Supplier 1: Farnell; Supplier Part Number 1: 2053041; ComponentLink1Description: Datasheet; ComponentLink1URL: http://cloud.samtec.com/catalog_english/TSW_TH.PDF
J234 J236 = CAVALIER_0603_O: Cavalier soudure "ouvert" + empreinte dipole 0603
J235 J237 = CAVALIER_0603_C: Cavalier soudure "fermé" + empreinte dipole 0603
R248 R249 = RC0603FR-070RL: as R211 on sheet Motorisation; Manufacturer Part Number: RC0603FR-070RL; Type: Thick Film; ComponentLink1Description: Manufacturer; ComponentLink1URL: http://www.yageo.com/NewPortal/_en/index.jsp; ComponentLink2Description: Datasheet; ComponentLink2URL: http://www.farnell.com/datasheets/2167052.pdf; Supplier 1: Farnell; Precision: ±1%; Supplier Part Number 1: 2309106; Supplier 2: JLCPCB; Supplier Part Number 2: C21189; Supplier Footprint 2: 0603
U202 U203 = ZLDO1117G33TA: LDO 3.3V 1A SOT223-3; Manufacturer: Diodes Inc.; Manufacturer Part Number: ZLDO1117G33TA; ComponentLink1URL: http://www.farnell.com/datasheets/1769101.pdf; ComponentLink1Description: Datasheet; ComponentLink2Description: Manufacturer; ComponentLink2URL: https://www.diodes.com/part/view/ZLDO1117; Type: LDO; Value: 3.3V; Supplier 2: JLCPCB; Supplier Part Number 2: C6186; Supplier 1: Farnell; Supplier Part Number 1: 1825376; Supplier Footprint 2: SOT-223

## Sheet Servomoteur.SchDoc
size A4; Author: Audran; CompanyName: Goldorak; Address1: Electrolab; Address2: 52 rue Paul Lescop; Address3: 92000 Nanterre; DocumentNumber: 6; SheetNumber: 6; SheetTotal: 8; ProjectName: Cartes_2017
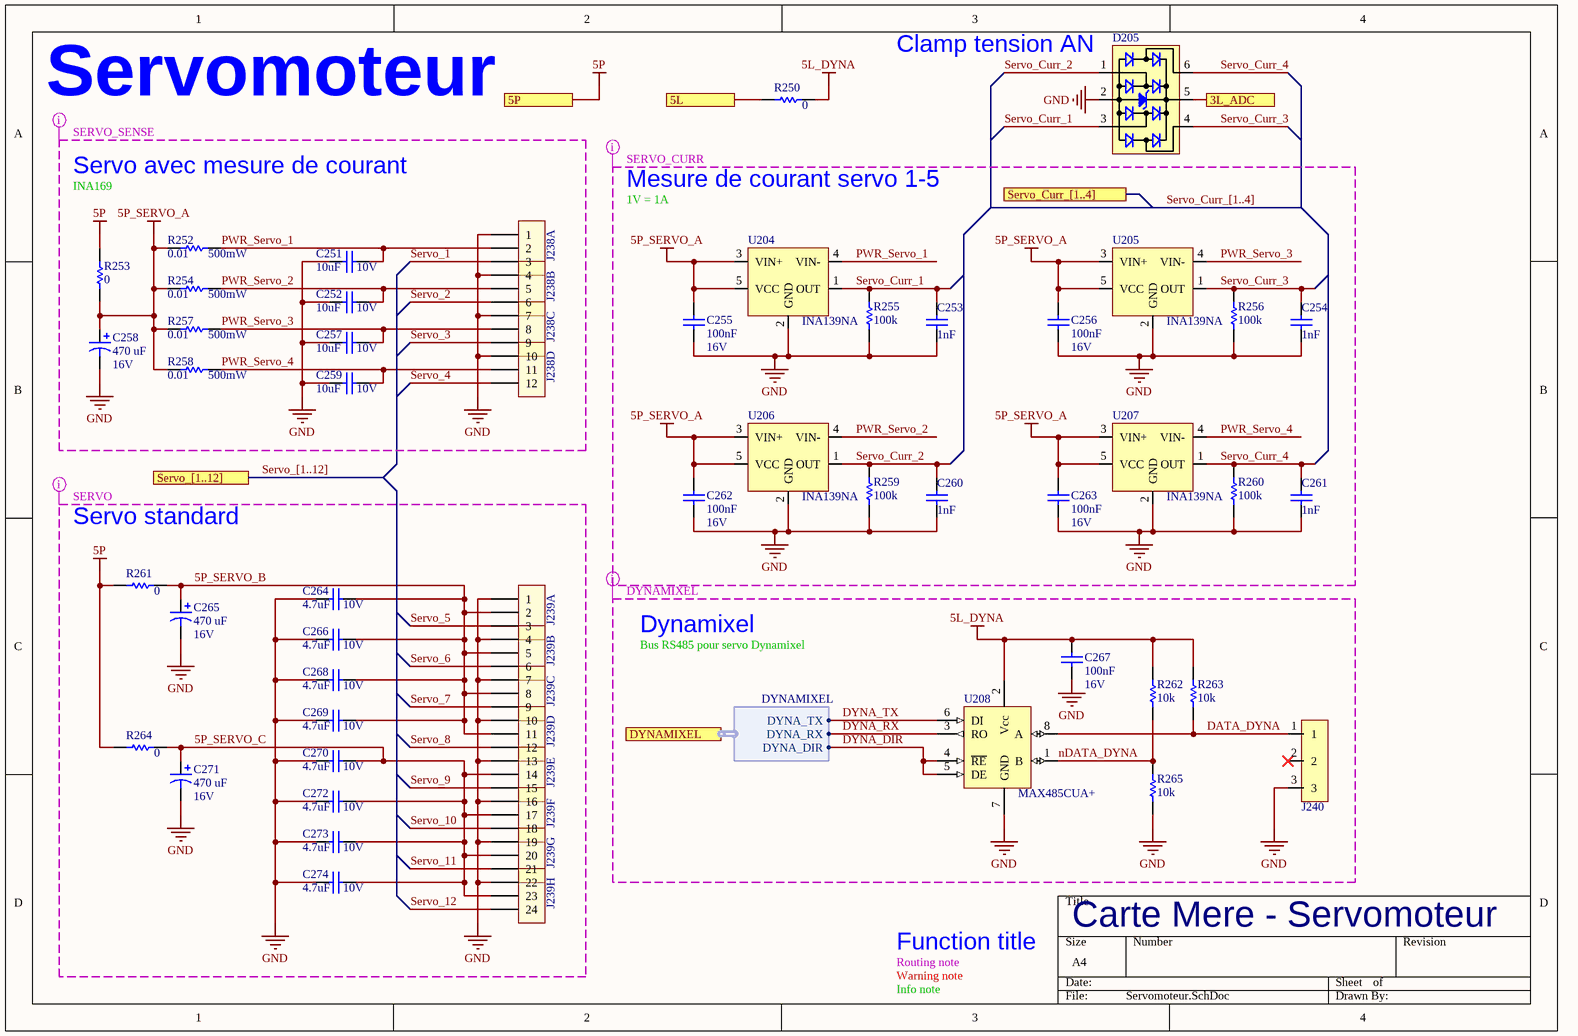
[diagram p7: Servomoteur.SchDoc]

### Parts
C251  10uF  RatedVoltage: 10V  [WCAP-CSGP_0805, 2x1.25x1.25]
C252  10uF  RatedVoltage: 10V  [WCAP-CSGP_0805, 2x1.25x1.25]
C253  1nF  [WCAP-CSGP_0402, 1x0.5x0.5]
C254  1nF  [WCAP-CSGP_0402, 1x0.5x0.5]
C255  100nF  RatedVoltage: 16V  [WCAP-CSGP_0402, 1x0.5x0.5]
C256  100nF  RatedVoltage: 16V  [WCAP-CSGP_0402, 1x0.5x0.5]
C257  10uF  RatedVoltage: 10V  [WCAP-CSGP_0805, 2x1.25x1.25]
C258  470 uF  RatedVoltage: 16V  [WCAP-ATG8_8x11.5x3.5x0.5]
C259  10uF  RatedVoltage: 10V  [WCAP-CSGP_0805, 2x1.25x1.25]
C260  1nF  [WCAP-CSGP_0402, 1x0.5x0.5]
C261  1nF  [WCAP-CSGP_0402, 1x0.5x0.5]
C262  100nF  RatedVoltage: 16V  [WCAP-CSGP_0402, 1x0.5x0.5]
C263  100nF  RatedVoltage: 16V  [WCAP-CSGP_0402, 1x0.5x0.5]
C264  4.7uF  RatedVoltage: 10V  [WCAP-CSGP_0603, 1.6x0.8x0.8]
C265  470 uF  RatedVoltage: 16V  [WCAP-ATG8_8x11.5x3.5x0.5]
C266  4.7uF  RatedVoltage: 10V  [WCAP-CSGP_0603, 1.6x0.8x0.8]
C267  100nF  RatedVoltage: 16V  [WCAP-CSGP_0402, 1x0.5x0.5]
C268  4.7uF  RatedVoltage: 10V  [WCAP-CSGP_0603, 1.6x0.8x0.8]
C269  4.7uF  RatedVoltage: 10V  [WCAP-CSGP_0603, 1.6x0.8x0.8]
C270  4.7uF  RatedVoltage: 10V  [WCAP-CSGP_0603, 1.6x0.8x0.8]
C271  470 uF  RatedVoltage: 16V  [WCAP-ATG8_8x11.5x3.5x0.5]
C272  4.7uF  RatedVoltage: 10V  [WCAP-CSGP_0603, 1.6x0.8x0.8]
C273  4.7uF  RatedVoltage: 10V  [WCAP-CSGP_0603, 1.6x0.8x0.8]
C274  4.7uF  RatedVoltage: 10V  [WCAP-CSGP_0603, 1.6x0.8x0.8]
D205  824001  [SOT-23-6L]  (value not drawn)
J238  TSW-104-08-F-T-RA  [TSW-104-08-F-T-RA]  (value not drawn)  (parts A,B,C,D of 4)
J239  TSW-104-08-F-T-RA  [TSW-108-08-F-T-RA]  (value not drawn)  (parts A,B,C,D,E,F,G,H of 8)
J240  22-03-5035  [20-03-5035]  (value not drawn)
R250  value 0  [RESC1608X06N]  (hidden comment: RC0603FR-070RL)
R252  value 0.01  Power: 500mW  [RESC2012X06N]  (hidden comment: CRF0805-FZ-R010ELF)
R253  value 0  [RESC1608X06N]  (hidden comment: RC0603FR-070RL)
R254  value 0.01  Power: 500mW  [RESC2012X06N]  (hidden comment: CRF0805-FZ-R010ELF)
R255  value 100k  [RESC1005X04N]  (hidden comment: RC0402FR-07100KL)
R256  value 100k  [RESC1005X04N]  (hidden comment: RC0402FR-07100KL)
R257  value 0.01  Power: 500mW  [RESC2012X06N]  (hidden comment: CRF0805-FZ-R010ELF)
R258  value 0.01  Power: 500mW  [RESC2012X06N]  (hidden comment: CRF0805-FZ-R010ELF)
R259  value 100k  [RESC1005X04N]  (hidden comment: RC0402FR-07100KL)
R260  value 100k  [RESC1005X04N]  (hidden comment: RC0402FR-07100KL)
R261  value 0  [RESC1608X06N]  (hidden comment: RC0603FR-070RL)
R262  value 10k  [RESC1005X04N]  (hidden comment: RC0402FR-0710KL)
R263  value 10k  [RESC1005X04N]  (hidden comment: RC0402FR-0710KL)
R264  value 0  [RESC1608X06N]  (hidden comment: RC0603FR-070RL)
R265  value 10k  [RESC1005X04N]  (hidden comment: RC0402FR-0710KL)
U204  INA139NA  [SOT23_95P280X145-5N]
U205  INA139NA  [SOT23_95P280X145-5N]
U206  INA139NA  [SOT23_95P280X145-5N]
U207  INA139NA  [SOT23_95P280X145-5N]
U208  MAX485CUA+  [MSOP-8]

### Ports
3L_ADC, 5L, 5P, DYNAMIXEL (harness DYNAMIXEL), Servo_[1..12], Servo_Curr_[1..4]

### Harnesses
DYNAMIXEL: DYNA_TX, DYNA_RX, DYNA_DIR

### Nets
3L_ADC: D205.5 ; port 3L_ADC
5L: R250.1 ; port 5L
5L_DYNA: C267.1 R250.2 R262.2 R263.2 U208.2(Vcc)
5P: R253.1 R261.1 R264.1 ; port 5P
5P_SERVO_A: C255.1 C256.1 C258.1 C262.1 C263.1 R252.1 R253.2 R254.1 R257.1 R258.1 U204.3(VIN+) U204.5(VCC) U205.3(VIN+) U205.5(VCC) U206.3(VIN+) U206.5(VCC) U207.3(VIN+) U207.5(VCC)
GND: C251.1 C252.1 C253.2 C254.2 C255.2 C256.2 C257.1 C258.2 C259.1 C260.2 C261.2 C262.2 C263.2 C264.2 C265.2 C266.2 C267.2 C268.2 C269.2 C270.2 C271.2 C272.2 C273.2 C274.2 D205.2 J238.1 J238.4 J238.7 J238.10 J239.1 J239.4 J239.7 J239.10 J239.13 J239.16 J239.19 J239.22 J240.3 R255.2 R256.2 R259.2 R260.2 R265.1 U204.2(GND) U205.2(GND) U206.2(GND) U207.2(GND) U208.7(GND)
5P_SERVO_B: C264.1 C265.1 C266.1 C268.1 C269.1 J239.2 J239.5 J239.8 J239.11 R261.2
5P_SERVO_C: C270.1 C271.1 C272.1 C273.1 C274.1 J239.14 J239.17 J239.20 J239.23 R264.2
DATA_DYNA: J240.1 R263.1 U208.8(A)
DYNA_DIR: U208.4(~{RE}) U208.5(DE) ; port DYNAMIXEL.DYNA_DIR
DYNA_RX: U208.3(RO) ; port DYNAMIXEL.DYNA_RX
DYNA_TX: U208.6(DI) ; port DYNAMIXEL.DYNA_TX
nDATA_DYNA: R262.1 R265.2 U208.1(B)
PWR_Servo_1: C251.2 J238.2 R252.2 U204.4(VIN-)
PWR_Servo_2: C252.2 J238.5 R254.2 U206.4(VIN-)
PWR_Servo_3: C257.2 J238.8 R257.2 U205.4(VIN-)
PWR_Servo_4: C259.2 J238.11 R258.2 U207.4(VIN-)
Servo_1: J238.3
Servo_2: J238.6
Servo_3: J238.9
Servo_4: J238.12
Servo_5: J239.3
Servo_6: J239.6
Servo_7: J239.9
Servo_8: J239.12
Servo_9: J239.15
Servo_10: J239.18
Servo_11: J239.21
Servo_12: J239.24
Servo_Curr_1: C253.1 D205.3 R255.1 U204.1(OUT)
Servo_Curr_2: C260.1 D205.1 R259.1 U206.1(OUT)
Servo_Curr_3: C254.1 D205.4 R256.1 U205.1(OUT)
Servo_Curr_4: C261.1 D205.6 R260.1 U207.1(OUT)

Not connected (* = marked no-connect by the designer): J240 2*

### Buses and harness runs
bus Servo_[1..12] = port Servo_[1..12]
bus Servo_Curr_[1..4] = port Servo_Curr_[1..4]

### Layout directives
net class DYNAMIXEL: 5L_DYNA, DATA_DYNA, DYNA_DIR, DYNA_RX, DYNA_TX, GND, nDATA_DYNA
net class SERVO_CURR: 5P_SERVO_A, GND, PWR_Servo_1, PWR_Servo_2, PWR_Servo_3, PWR_Servo_4, Servo_Curr_1, Servo_Curr_2, Servo_Curr_3, Servo_Curr_4, Servo_Curr_[1..4]
net class SERVO_SENSE: 5P, 5P_SERVO_A, GND, PWR_Servo_1, PWR_Servo_2, PWR_Servo_3, PWR_Servo_4, Servo_1, Servo_2, Servo_3, Servo_4
net class SERVO: 5P, 5P_SERVO_B, 5P_SERVO_C, GND, Servo_5, Servo_6, Servo_7, Servo_8, Servo_9, Servo_10, Servo_11, Servo_12

### Notes on the sheet
- Servomoteur
- (near D205) Clamp tension AN
- Servo avec mesure de courant
- INA169
- 1V = 1A
- Mesure de courant servo 1-5
- Servo standard
- Dynamixel
- Bus RS485 pour servo Dynamixel
- Routing note
- Warning note
- Function title
- Carte Mere - Servomoteur
- Info note

### Library data of the parts
C251 C252 C257 C259 = WCAP-CSGP, 885012207026: as C214 on sheet Motorisation; ComponentLink1Description: Datasheet; ComponentLink1URL: http://katalog.we-online.com/pbs/datasheet/885012207026.pdf; Manufacturer Part Number: 885012207026; Value: 10uF; Size: 0805; CeramicType: X7R; Supplier 1: Farnell; Supplier Part Number 1: 2495189; Supplier Part Number 2: C15850; Supplier 2: JLCPCB; Supplier Footprint 2: 0805
C253 C254 C260 C261 = WCAP-CSGP, 885012205061: CAP CER 1nF 50V X7R 0402; Manufacturer: Wurth Elektronik; ComponentLink1Description: Datasheet; ComponentLink1URL: http://katalog.we-online.com/pbs/datasheet/885012205061.pdf; Manufacturer Part Number: 885012205061; Value: 1nF; Size: 0402; CeramicType: X7R; RatedVoltage: 50V; Supplier 2: JLCPCB; Supplier Part Number 2: C1523; Supplier Footprint 2: 0402
C255 C256 C262 C263 C267 = WCAP-CSGP, 885012205037: as C215 on sheet Motorisation; ComponentLink1Description: Datasheet; ComponentLink1URL: http://katalog.we-online.com/pbs/datasheet/885012205037.pdf; Manufacturer Part Number: 885012205037; Value: 100nF; Size: 0402; CeramicType: X7R; Supplier 2: JLCPCB; Supplier Part Number 2: C1525; Supplier Footprint 2: 0402
C258 C265 C271 = WCAP-ATG8, 860010374012: as C224 on sheet Power; ComponentLink1Description: Datasheet; ComponentLink1URL: http://katalog.we-online.de/pbs/datasheet/860010374012.pdf; Manufacturer Part Number: 860010374012; Value: 470 uF; Size: 8mmx11.5mm
C264 C266 C268-C270 C272-C274 = WCAP-CSGP, 885012106012: CAP CER 4.7UF 10V X5R 0603; Manufacturer: Wurth Elektronik; ComponentLink1Description: Datasheet; ComponentLink1URL: http://katalog.we-online.com/pbs/datasheet/885012106012.pdf; Manufacturer Part Number: 885012106012; Value: 4.7uF; Size: 0603; CeramicType: X5R; Supplier 2: JLCPCB; Supplier Part Number 2: C19666; Supplier Footprint 2: 0603
D205 = 824001: WE-TVS TVS Diode 4+1Ch 5V SOT23-6L; Manufacturer: Wurth Elektronik; ComponentLink1Description: Datasheet; ComponentLink1URL: https://www.we-online.com/catalog/datasheet/824001.pdf; Manufacturer Part Number: 824001; Supplier 1: Farnell; Supplier Part Number 1: 1748613; Type: TVS; Value: 5V; Supplier 2: JLCPCB; Supplier Part Number 2: C85364; Supplier Footprint 2: SOT-23-6L
J238 = TSW-104-08-F-T-RA: as J230 on sheet Power; Manufacturer Part Number: TSW-104-08-F-T-RA; Supplier 1: Farnell; Supplier Part Number 1: 2053041; ComponentLink1Description: Datasheet; ComponentLink1URL: http://cloud.samtec.com/catalog_english/TSW_TH.PDF
J239 = TSW-108-08-F-T-RA: CONN HEADER R/A 3L x 8POS 2.54MM; Manufacturer: SAMTEC; Manufacturer Part Number: TSW-104-08-F-T-RA; Supplier 1: Farnell; ComponentLink1Description: Datasheet; ComponentLink1URL: http://cloud.samtec.com/catalog_english/TSW_TH.PDF; Supplier Part Number 1: 2053046
J240 = 20-03-5035: CONN HEADER VERT 3POS 2.5MM; Manufacturer: MOLEX; Supplier 1: Farnell; Supplier Part Number 1: 9979620; Manufacturer Part Number: 22-03-5035; ComponentLink1URL: http://www.farnell.com/datasheets/1801024.pdf; ComponentLink1Description: Datasheet; ComponentLink2URL: http://www.farnell.com/cad/495071.pdf  http://www.farnell.com/cad/1533907.pdf  http://www.farnell.com/cad/1533907.pdf; ComponentLink2Description: Drawings
R250 R253 R261 R264 = RC0603FR-070RL: as R211 on sheet Motorisation; Manufacturer Part Number: RC0603FR-070RL; Type: Thick Film; ComponentLink1Description: Manufacturer; ComponentLink1URL: http://www.yageo.com/NewPortal/_en/index.jsp; ComponentLink2Description: Datasheet; ComponentLink2URL: http://www.farnell.com/datasheets/2167052.pdf; Supplier 1: Farnell; Precision: ±1%; Supplier Part Number 1: 2309106; Supplier 2: JLCPCB; Supplier Part Number 2: C21189; Supplier Footprint 2: 0603
R252 R254 R257 R258 = CRF0805-FZ-R010ELF: RES 0.01 OHM 1% 500mW 0805; Manufacturer: Bourns; Vmax: 200V; Type: Thick film; Manufacturer Part Number: CRF0805-FZ-R010ELF; Precision: ±1%; ComponentLink1URL: https://www.bourns.com/docs/Product-Datasheets/CRF.pdf; ComponentLink1Description: Manufacturer; ComponentLink2URL: http://www.farnell.com/datasheets/1970564.pdf; ComponentLink2Description: Datasheet; Supplier 1: Farnell; Supplier Part Number 1: 2372977
R255 R256 R259 R260 = RC0402FR-07100KL: RES SMD 100K OHM 1% 1/16W 0402; Manufacturer: Yageo; Power: 63mW; Vmax: 50V; Type: Thick Film; ComponentLink1Description: Manufacturer; ComponentLink1URL: http://www.yageo.com/NewPortal/_en/index.jsp; ComponentLink2Description: Datasheet; ComponentLink2URL: http://www.farnell.com/datasheets/2167052.pdf; Manufacturer Part Number: RC0402FR-07100KL; Supplier 1: Farnell; Supplier Part Number 1: 9239472; Precision: ±1%; Supplier 2: JLCPCB; Supplier Part Number 2: C25741; Supplier Footprint 2: 0402
R262 R263 R265 = RC0402FR-0710KL: as R220 on sheet Motorisation; Type: Thick Film; ComponentLink1Description: Manufacturer; ComponentLink1URL: http://www.yageo.com/NewPortal/_en/index.jsp; ComponentLink2Description: Datasheet; ComponentLink2URL: http://www.farnell.com/datasheets/2167052.pdf; Supplier 1: Farnell; Supplier Part Number 1: 9239359; Manufacturer Part Number: RC0402FR-0710KL; Precision: ±1%; Supplier 2: JLCPCB; Supplier Part Number 2: C25744; Supplier Footprint 2: 0402
U204-U207 = INA139NA: IC CURRENT MONITOR 0.5% SOT23-5; Manufacturer: Texas Instruments; Manufacturer Part Number: INA139NA; ComponentLink1URL: http://www.ti.com/lit/ds/symlink/ina139.pdf; ComponentLink1Description: Datasheet; Supplier 1: Farnell; Supplier Part Number 1: 3118123
U208 = MAX485CUA+: IC TXRX RS485/RS422 8-UMAX; Manufacturer: Maxim Integrated; Manufacturer Part Number: MAX485CUA+; ComponentLink1URL: http://datasheets.maximintegrated.com/en/ds/MAX1487-MAX491.pdf; ComponentLink1Description: Datasheet; Supplier 1: Farnell; Supplier Part Number 1: 2511735